# EAGLE design ESP32-Proto2-Layout-D1 (EAGLE 9.6.2)
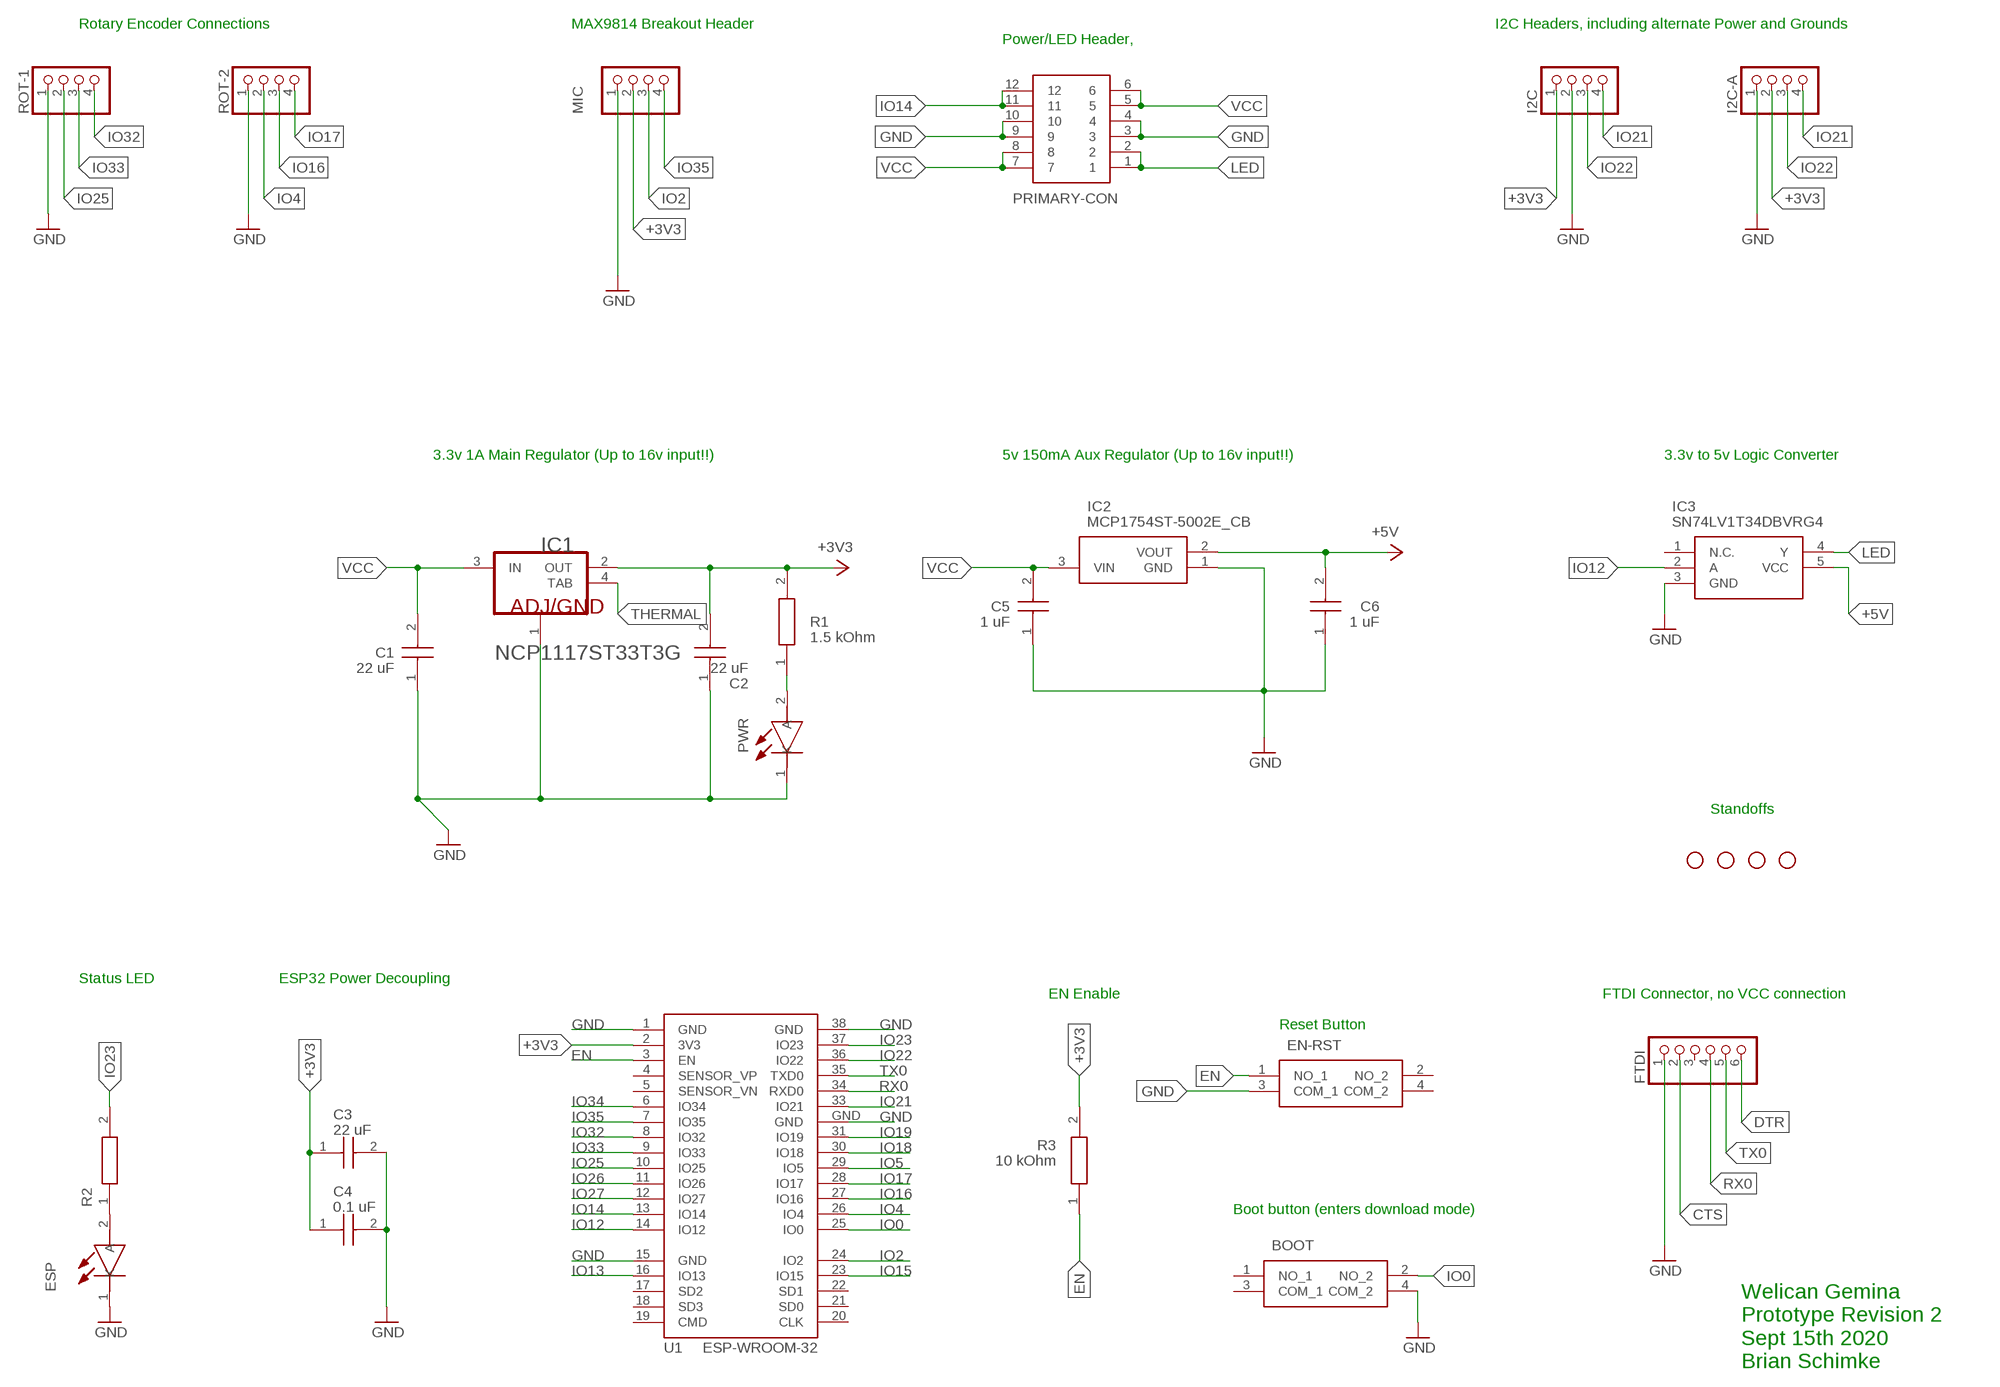
[diagram p0: schematic, sheet 1]

## Parts
BOOT  PTS647SK70SMTR2LFS  [PTS647SK70SMTR2LFS]
C1  22 uF  C1206C226M4PACTU  [CAPC3216X180N]
C2  22 uF  C1206C226M4PACTU  [CAPC3216X180N]
C3  22 uF  C1206C226M4PACTU  [CAPC3216X180N]
C4  0.1 uF  C1206C226M4PACTU  [CAPC3216X180N]
C5  1 uF  C1206C226M4PACTU  [CAPC3216X180N]
C6  1 uF  C1206C226M4PACTU  [CAPC3216X180N]
EN-RST  PTS647SK70SMTR2LFS  [PTS647SK70SMTR2LFS]
ESP  150120AS75000  [LEDSC320X160X78-2N]
FTDI  PINHD-1X6  [1X06]
H1  STAND-OFF  [STAND-OFF]
H2  STAND-OFF  [STAND-OFF]
H3  STAND-OFF  [STAND-OFF]
H4  STAND-OFF  [STAND-OFF]
I2C  PINHD-1X4  [1X04]
I2C-A  PINHD-1X4  [1X04]
IC1  ON_SEMICONDUCTOR_NCP1117ST33T3GON_SEMICONDUCTOR_NCP1117ST33T3G_0_0  [ON_SEMICONDUCTOR_NCP1117ST33T3G_0]
IC2  MCP1754ST-5002E_CB  [SOT95P255X145-3N]
IC3  SN74LV1T34DBVRG4  [SOT95P280X145-5N]
MIC  PINHD-1X4  [1X04]
PRIMARY-CON  1-2834015-6  [SHDR12W90P508X254_2X6_1824X128]
PWR  150120AS75000  [LEDSC320X160X78-2N]
R1  1.5 kOhm  CRCW12061K00FKEB  [RESC3216X60N]
R2  CRCW12061K00FKEB  [RESC3216X60N]
R3  10 kOhm  CRCW12061K00FKEB  [RESC3216X60N]
ROT-1  PINHD-1X4  [1X04]
ROT-2  PINHD-1X4  [1X04]
U1  ESP-WROOM-32  [ESP-WROOM-32]

## Nets
+3V3: C2.2 C3.1 C4.1 I2C-A.2 I2C.1 IC1.2(OUT) MIC.2 R1.2 R3.2 U1.2(3V3)
+5V: C6.2 IC2.2(VOUT) IC3.5(VCC)
CTS: FTDI.2
DTR: FTDI.6
EN: EN-RST.1(NO_1) R3.1 U1.3(EN)
GND: BOOT.4(COM_2) C1.1 C2.1 C3.2 C4.2 C5.1 C6.1 EN-RST.3(COM_1) ESP.1(K) FTDI.1 I2C-A.1 I2C.2 IC1.1(ADJ/GND) IC2.1(GND) IC3.3(GND) MIC.1 PRIMARY-CON.3 PRIMARY-CON.4 PRIMARY-CON.9 PRIMARY-CON.10 PWR.1(K) ROT-1.1 ROT-2.1 U1.1(GND) U1.15(GND) U1.38(GND) U1.GND
IO0: BOOT.2(NO_2) U1.25(IO0)
IO2: MIC.3 U1.24(IO2)
IO4: ROT-2.2 U1.26(IO4)
IO5: U1.29(IO5)
IO12: IC3.2(A) U1.14(IO12)
IO13: U1.16(IO13)
IO14: PRIMARY-CON.11 PRIMARY-CON.12 U1.13(IO14)
IO15: U1.23(IO15)
IO16: ROT-2.3 U1.27(IO16)
IO17: ROT-2.4 U1.28(IO17)
IO18: U1.30(IO18)
IO19: U1.31(IO19)
IO21: I2C-A.4 I2C.4 U1.33(IO21)
IO22: I2C-A.3 I2C.3 U1.36(IO22)
IO23: R2.2 U1.37(IO23)
IO25: ROT-1.2 U1.10(IO25)
IO26: U1.11(IO26)
IO27: U1.12(IO27)
IO32: ROT-1.4 U1.8(IO32)
IO33: ROT-1.3 U1.9(IO33)
IO34: U1.6(IO34)
IO35: MIC.4 U1.7(IO35)
LED: IC3.4(Y) PRIMARY-CON.1 PRIMARY-CON.2
N$1: PWR.2(A) R1.1
N$2: ESP.2(A) R2.1
RX0: FTDI.4 U1.34(RXD0)
THERMAL: IC1.4(TAB)
TX0: FTDI.5 U1.35(TXD0)
VCC: C1.2 C5.2 IC1.3(IN) IC2.3(VIN) PRIMARY-CON.5 PRIMARY-CON.6 PRIMARY-CON.7 PRIMARY-CON.8
Unconnected: BOOT.1(NO_1) BOOT.3(COM_1) EN-RST.2(NO_2) EN-RST.4(COM_2) FTDI.3 IC3.1(N.C.) U1.4(SENSOR_VP) U1.5(SENSOR_VN) U1.17(SD2) U1.18(SD3) U1.19(CMD) U1.20(CLK) U1.21(SD0) U1.22(SD1)

## Notes on the sheet
- Rotary Encoder Connections | MAX9814 Breakout Header | I2C Headers, including alternate Power and Grounds
- Power/LED Header,
- 3.3v 1A Main Regulator (Up to 16v input!!) | 5v 150mA Aux Regulator (Up to 16v input!!) | 3.3v to 5v Logic Converter
- Standoffs
- Status LED | ESP32 Power Decoupling
- EN Enable | FTDI Connector, no VCC connection
- Reset Button
- Boot button (enters download mode)
- Welican Gemina
  Prototype Revision 2
  Sept 15th 2020
  Brian Schimke

## Library data of the parts
BOOT EN-RST = SamacSys_Parts:PTS647SK70SMTR2LFS: Tactile Switches 50mA 12VDC, 2.5N 7.0mm H, G leads Source: Datasheet <https:////www.ckswitches.com/media/2567/pts647.pdf>; DESCRIPTION: Tactile Switches 50mA 12VDC, 2.5N 7.0mm H, G leads; HEIGHT: 7.2mm; MANUFACTURER_NAME: C & K COMPONENTS; MANUFACTURER_PART_NUMBER: PTS647SK70SMTR2LFS; MOUSER_PART_NUMBER: 611-PTS647SK70SMTR2L; MOUSER_PRICE-STOCK: https://www.mouser.co.uk/ProductDetail/CK/PTS647SK70SMTR2LFS?qs=PqoDHHvF64%2FG2CdR6DYUFw%3D%3D
C1-C6 = SamacSys_Parts:C1206C226M4PACTU: KEMET 1206 (3216M) 22uF MLCC 16V dc +/-20% SMD C1206C226M4PACTU Source: Datasheet <https://api.kemet.com/component-edge/download/specsheet/C1206C226M4PACTU.pdf>; DESCRIPTION: KEMET 1206 (3216M) 22uF MLCC 16V dc +/-20% SMD C1206C226M4PACTU; HEIGHT: 1.8mm; MANUFACTURER_NAME: Kemet; MANUFACTURER_PART_NUMBER: C1206C226M4PACTU; MOUSER_PART_NUMBER: 80-C1206C226M4P; MOUSER_PRICE-STOCK: https://www.mouser.co.uk/ProductDetail/KEMET/C1206C226M4PACTU?qs=vBH1GPjCw2UZFSd%252B4IU1Qg%3D%3D
ESP PWR = SamacSys_Parts:150120AS75000: WL-SMCW SMD chip LED top view monocolor%D waterclear Source: Datasheet <http://katalog.we-online.com/led/datasheet/150120AS75000.pdf>; DESCRIPTION: WL-SMCW SMD chip LED top view monocolor%D waterclear; HEIGHT: mm; MANUFACTURER_NAME: Wurth Elektronik; MANUFACTURER_PART_NUMBER: 150120AS75000; MOUSER_PART_NUMBER: 710-150120AS75000; MOUSER_PRICE-STOCK: https://www.mouser.co.uk/ProductDetail/Wurth-Elektronik/150120AS75000?qs=LlUlMxKIyB3dthGDbNsiXQ%3D%3D
FTDI = pinhead:PINHD-1X6: PIN HEADER
H1-H4 = SparkFun-Hardware:STAND-OFF: Stand Off Drill holes for mechanically mounting via screws, standoffs, etc. Note: Use the keepout ring to avoid running the screw head into surrounding components. Variant Overviews STAND-OFF - Mechanical footprint for a #4 phillips button head screw. STAND-OFF-TIGHT - Mechanical footprint for a #4 phillips button head screw, Example SparkFun Products Screw - Phillips Head (1/4", 4-40, 10 pack) <https://www.sparkfun.com/products/10453> (PRT-10453) Screw - Phillips Head (1/2", 4-40, 10 pack) <https://www.sparkfun.com/products/10452> (PRT-10452) Screw - Phillips Head (3/4", 4-40, 10 pack) <https://www.sparkfun.com/products/10451> (PRT-10451) Screw - Phillips Head (1", 4-40, 10 pack) <https://www.sparkfun.com/products/10450> (PRT-10450)
I2C I2C-A MIC ROT-1 ROT-2 = pinhead:PINHD-1X4: PIN HEADER
IC1 = ON Semiconductor - NCP1117ST33T3G:ON_SEMICONDUCTOR_NCP1117ST33T3G: ONSC-NCP1117-SOT223-4; CASE_CODE_IMPERIAL: 0603; CASE_CODE_METRIC: 1608; CASE_PACKAGE: 0603; CIIVA_IDS: 19354120; COMPONENT_LINK_1_DESCRIPTION: Manufacturer URL; COMPONENT_LINK_1_URL: http://www.onsemi.com/; DATASHEET: http://www.onsemi.com/pub_link/Collateral/NCP1117-D.PDF; DATASHEET_VERSION: Rev. 27, 09/2014; FOOTPRINT_VARIANT_NAME_0: Manufacturer Recommended; HEIGHT: 0.45 mm; IMPORTED: yes; IMPORTED_FROM: vault; IMPORT_TS: 1521845423; LENGTH: 1.55 mm; MAX_OPERATING_TEMPERATURE: 155 degC; MF: ON Semiconductor; MIN_OPERATING_TEMPERATURE: -55 degC; MOUNT: Surface Mount; MPN: NCP1117ST33T3G; PACKAGE: SOT-223-4-318H-01_A; PACKAGE_DESCRIPTION: 4-Pin Small Outline Transistor, Body 6.5 x 3.5 mm, Pitch 2.3 mm; PACKAGE_QUANTITY: 5000; PACKAGING: Tape and Reel; POWER_RATING: 100 mW; PREFIX: U; RADIATION_HARDENING: No; REACH_SVHC: Unknown; RELEASE_DATE: 1475065185; RESISTANCE: 220 kohm; RO_HSCOMPLIANT: true; TOLERANCE: 1%; TYPE_RESISTOR: Thick Film; VAULT_GUID: C6E429D0-32F2-4CA3-9C68-29F3FC9DADEB; VAULT_REVISION: 6AD56B9F-4B97-41F2-91E8-97C557B92B31; VOLTAGE_RATING: 75 V; WEIGHT: 7.1E-05 oz; WIDTH: 0.85 mm
IC2 = SamacSys_Parts:MCP1754ST-5002E_CB: LDO regulator,voltage,5.0V,150mA,SOT23A Microchip MCP1754ST-5002E/CB, Single Linear Voltage Regulator, 150mA 5 V, 2%, 3-Pin SOT-23A Source: Datasheet; DESCRIPTION: LDO regulator,voltage,5.0V,150mA,SOT23A Microchip MCP1754ST-5002E/CB, Single Linear Voltage Regulator, 150mA 5 V, 2%, 3-Pin SOT-23A; HEIGHT: 1.45mm; MANUFACTURER_NAME: Microchip; MANUFACTURER_PART_NUMBER: MCP1754ST-5002E/CB; MOUSER_PART_NUMBER: 579-MCP1754T-5002ECB; MOUSER_PRICE-STOCK: https://www.mouser.co.uk/ProductDetail/Microchip-Technology/MCP1754ST-5002E-CB?qs=geWWqIMx8YpBnNSotTcMsA%3D%3D
IC3 = SamacSys_Parts:SN74LV1T34DBVRG4: Single Power Supply BUFFER Logic Level Shifter (no enable) Source: Datasheet <http://www.ti.com/lit/gpn/sn74lv1t34>; DESCRIPTION: Single Power Supply BUFFER Logic Level Shifter (no enable); HEIGHT: 1.45mm; MANUFACTURER_NAME: Texas Instruments; MANUFACTURER_PART_NUMBER: SN74LV1T34DBVRG4; MOUSER_PART_NUMBER: 595-SN74LV1T34DBVRG4; MOUSER_PRICE-STOCK: https://www.mouser.co.uk/ProductDetail/Texas-Instruments/SN74LV1T34DBVRG4?qs=vdi0iO8H4N10R%252Bt%252BjmxZrg%3D%3D
PRIMARY-CON = SamacSys_Parts:1-2834015-6: Fixed Terminal Blocks 6POS 2.54MM TES CONN Source: Datasheet; DESCRIPTION: Fixed Terminal Blocks 6POS 2.54MM TES CONN; HEIGHT: 13.9mm; MANUFACTURER_NAME: TE Connectivity; MANUFACTURER_PART_NUMBER: 1-2834015-6; MOUSER_PART_NUMBER: 571-1-2834015-6; MOUSER_PRICE-STOCK: https://www.mouser.co.uk/ProductDetail/TE-Connectivity-PB/1-2834015-6?qs=0ns%252B%2F2Cp7jExtUGsWLqwmw%3D%3D
R1-R3 = SamacSys_Parts:CRCW12061K00FKEB: Thick Film Resistors - SMD 1/4watt 1Kohms 1% Source: Datasheet <http://www.vishay.com/docs/20035/dcrcwe3.pdf>; DESCRIPTION: Thick Film Resistors - SMD 1/4watt 1Kohms 1%; HEIGHT: 0.6mm; MANUFACTURER_NAME: Vishay; MANUFACTURER_PART_NUMBER: CRCW12061K00FKEB; MOUSER_PART_NUMBER: 71-CRCW12061K00FKEB; MOUSER_PRICE-STOCK: https://www.mouser.co.uk/ProductDetail/Vishay-Dale/CRCW12061K00FKEB?qs=3XLFQ9LoC1wOYUVdt2fbOg%3D%3D
U1 = esp32:ESP-WROOM-32: Espressif Systems ESP-WROOM-32

## Board
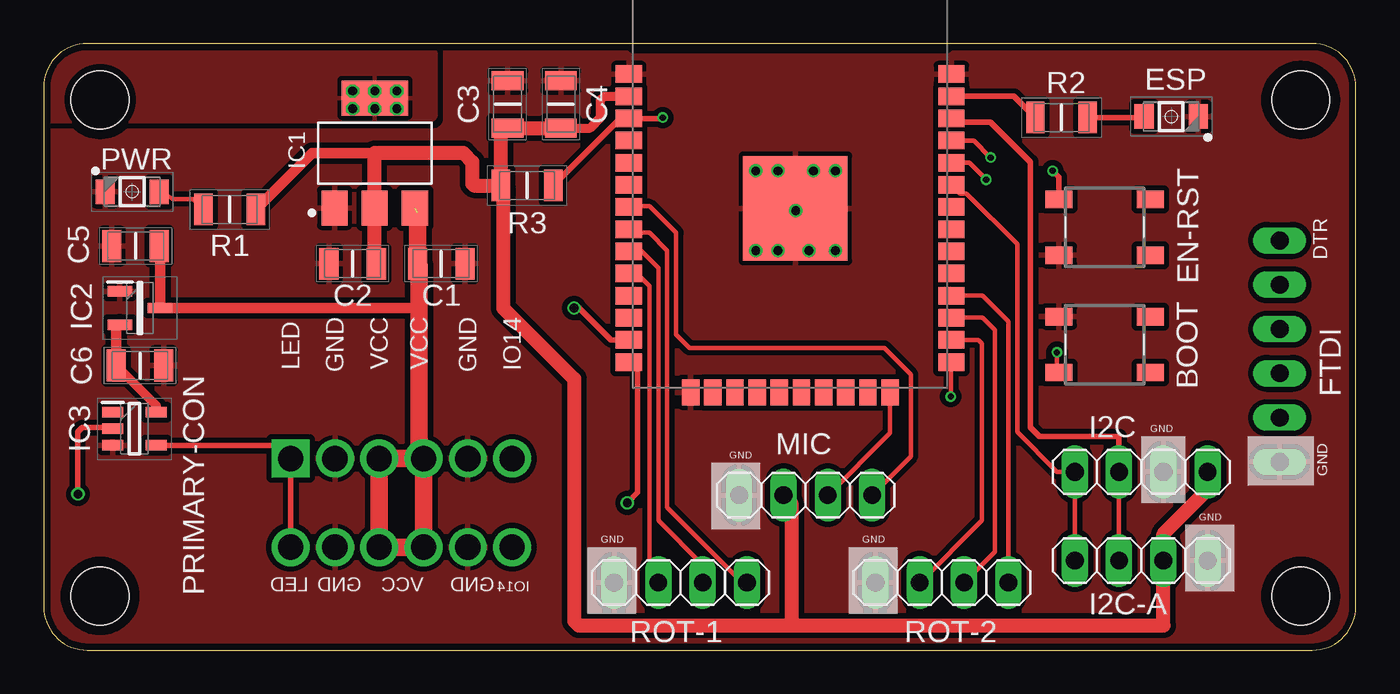
[diagram p1: board, top side]
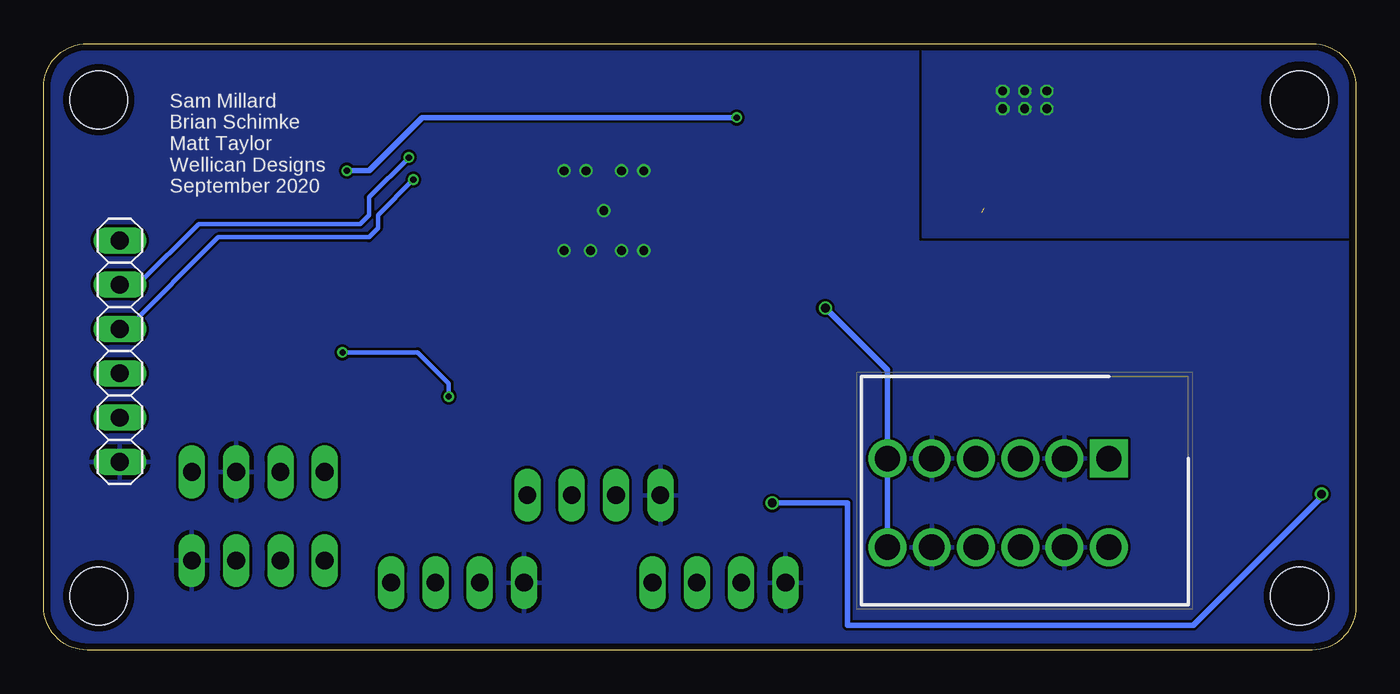
[diagram p2: board, bottom side, seen from below]

Size 75.23 x 34.79 mm. Coordinates in mm from the lower left corner, seen from the top.
Outline: 75.24,2.5 75.24,32.29 arc90 72.74,34.79 2.5,34.79 arc90 0,32.29 0,2.5 arc90 2.5,0 72.74,0 arc90 75.24,2.5
Copper layers (1*16): Top 0.035559375mm / dielectric 1.6mm / Bottom 0.035559375mm
Design rules "oshpark-2layer": minimum track width 6mil, minimum drill 10mil, track to track 6mil, track to pad 6mil, pad to pad 6mil, via to via 6mil, smd to smd 6mil, copper to edge 15mil, drill to drill 6mil, minimum pad ring 5mil, minimum via ring 5mil, stop-mask expansion 2.5mil, vias tented up to drill 0mil, thermal gap 10mil

### Footprints (pad centres in the part's own frame; a part is rotated, then mirrored left to right if it is on the bottom)
PTS647SK70SMTR2LFS = smd 1.55 x 1: 1 -2.625,1.6; 2 2.625,1.6; 3 -2.625,-1.6; 4 2.625,-1.6
CAPC3216X180N = smd 1.1 x 1.82: 1 -1.36,0; 2 1.36,0
LEDSC320X160X78-2N = smd 1.1 x 1.4: 1 -1.55,0; 2 1.55,0
1X06 = drill 1.016 long: 1 -6.35,0; 2 -3.81,0; 3 -1.27,0; 4 1.27,0; 5 3.81,0; 6 6.35,0
STAND-OFF = hole 3.302: 0,0
1X04 = drill 1.016 long: 1 -3.81,0; 2 -1.27,0; 3 1.27,0; 4 3.81,0
ON_SEMICONDUCTOR_NCP1117ST33T3G_0 = smd 2 x 1.5: 1 -3.15,2.3; 2 -3.15,0; 3 -3.15,-2.3 | smd 2 x 3.8: 4 3.15,0
SOT95P255X145-3N = smd 1.4 x 0.6: 1 -1.15,0.95; 2 -1.15,-0.95; 3 1.15,0
SOT95P280X145-5N = smd 1.2 x 0.6: 1 -1.25,0.95; 2 -1.25,0; 3 -1.25,-0.95; 4 1.25,-0.95; 5 1.25,0.95
SHDR12W90P508X254_2X6_1824X128 = drill 1.45 pad 2.175 square: 1 0,0 | drill 1.45 pad 2.175: 2 0,5.08; 3 2.54,0; 4 2.54,5.08; 5 5.08,0; 6 5.08,5.08; 7 7.62,0; 8 7.62,5.08; 9 10.16,0; 10 10.16,5.08; 11 12.7,0; 12 12.7,5.08
RESC3216X60N = smd 1.05 x 1.8: 1 -1.5,0; 2 1.5,0
ESP-WROOM-32 = smd 1.5 x 1: 1 -9.25,7; 2 -9.25,5.73; 3 -9.25,4.46; 4 -9.25,3.19; 5 -9.25,1.92; 6 -9.25,0.65; 7 -9.25,-0.62; 8 -9.25,-1.89; 9 -9.25,-3.16; 10 -9.25,-4.43; 11 -9.25,-5.7; 12 -9.25,-6.97; 13 -9.25,-8.24; 14 -9.25,-9.51; 25 9.25,-9.51; 26 9.25,-8.24; 27 9.25,-6.97; 28 9.25,-5.7; 29 9.25,-4.43; 30 9.25,-3.16; 31 9.25,-1.89; 32 9.25,-0.62; 33 9.25,0.65; 34 9.25,1.92; 35 9.25,3.19; 36 9.25,4.46; 37 9.25,5.73; 38 9.25,7 | smd 1 x 1.5: 15 -5.7,-11.25; 16 -4.43,-11.25; 17 -3.16,-11.25; 18 -1.89,-11.25; 19 -0.62,-11.25; 20 0.65,-11.25; 21 1.92,-11.25; 22 3.19,-11.25; 23 4.46,-11.25; 24 5.73,-11.25 | smd 6 x 6: GND 0.3,-0.7

### Placement (x,y rotation side)
BOOT  60.83,17.53 180 top
C1  22.8,22.16 180 top
C2  17.72,22.16 0 top
C3  26.61,31.31 90 top
C4  29.65,31.31 90 top
C5  5.27,23.18 0 top
C6  5.52,16.32 180 top
EN-RST  60.83,24.26 0 top
ESP  64.64,30.61 180 top
FTDI  70.87,17.14 90 bottom
H1  3.24,31.56 0 top
H2  72.07,3.11 0 top
H3  72.07,31.56 0 top
H4  3.24,3.11 0 top
I2C  62.93,10.22 180 top
I2C-A  62.93,5.14 180 top
IC1  18.99,28.51 90 top
IC2  5.52,19.62 0 top
IC3  5.21,12.7 0 top
MIC  43.69,8.89 0 top
PRIMARY-CON  14.16,10.99 180 bottom
PWR  5.08,26.29 0 top
R1  10.67,25.27 0 top
R2  58.36,30.54 180 top
R3  27.71,26.65 180 top
ROT-1  36.51,3.87 0 top
ROT-2  51.5,3.87 0 top
U1  42.8,26.04 0 top

### Tracks (layer width: path | path; a pad name or v marks a point on that pad's centre or on a via)
+3V3
  Top 0.508: 24.57,26.73 24.66,26.65 | 18.95,28.22 19.24,28.51 | 26.21,29.55 C3.1 | C4.1 31.34,29.95 31.94,30.54 31.94,31.56 32.15,31.77 U1.2 | 18.95,22.29 C2.2
  Top 0.61: 19.24,28.51 15.41,28.51 R1.2
  Top 0.813: 24.57,26.73 24.57,28 24.07,28.51 19.24,28.51 18.99,28.51 IC1.2 18.99,22.16 C2.2 | 24.66,26.65 R3.2 | R3.2 26.21,29.55 | C3.1 C4.1 | I2C.1 66.74,9.21 64.2,6.67 I2C-A.2 64.2,1.42 42.86,1.42 | R3.2 26.35,26.51 26.35,19.62 30.42,15.56 30.42,1.68 30.67,1.42 42.86,1.42 | MIC.2 42.86,8.45 42.86,1.42
+5V
  Top 0.508: C6.2 6.46,14.03 IC3.5
  Top 0.61: C6.2 4.16,18.46 IC2.2
EN  (via drill 0.35)
  Top 0.305: R3.1 33.06,30.5 U1.3 35.45,30.5 v35.5,30.54 | v57.85,27.5 58.21,27.14 EN-RST.1
  Bottom 0.305: v35.5,30.54 53.53,30.54 56.58,27.5 v57.85,27.5
GND  (via drill 0.5)
  other vias: 40.83,27.5 42.1,27.5 44.13,27.5 45.4,27.5 40.83,22.92 42.1,22.92 43.12,25.21 43.88,22.92 45.4,22.92
  pour Top (isolate 0.305, rank 2): 0.19,34.61 75.12,34.61 75.12,32.83 75.12,0.06 0.19,0.06 0.19,1.08
  pour Bottom (rank 2): 0.19,0.06 0.7,0.06 75.12,0.06 75.12,0.57 75.12,34.61 74.87,34.61 0.19,34.35
IO0  (via drill 0.35)
  Top 0.254: BOOT.2 58.1,16.03 v58.1,17.08 | U1.25 52.01,16.48 v52.01,14.54
  Bottom 0.254: v58.1,17.08 53.78,17.08 52.01,15.3 v52.01,14.54
IO2
  Top 0.254: U1.24 48.53,12.46 MIC.3
IO4
  Top 0.254: U1.26 53.58,17.79 53.78,17.59 53.78,7.43 ROT-2.2
IO12  (via drill 0.5)
  Top 0.305: U1.14 34.06,16.02 34.06,9.04 v33.46,8.45 | v1.97,8.95 1.97,12.51 2.22,12.76 3.89,12.76 IC3.2
  Bottom 0.305: v33.46,8.45 29.15,8.45 29.15,1.42 9.33,1.42 1.97,8.79 v1.97,8.95
IO14  (via drill 0.5)
  Top 0.305: U1.13 32.53,17.79 30.71,19.62 v30.42,19.62
  Bottom 0.305: v30.42,19.62 26.86,16.07 PRIMARY-CON.11 PRIMARY-CON.12
IO16
  Top 0.254: U1.27 53.83,19.07 54.55,18.35 54.55,5.65 ROT-2.3
IO17
  Top 0.254: U1.28 53.83,20.34 55.31,18.86 ROT-2.4
IO21
  Top 0.254: U1.33 52.54,26.19 52.91,26.19 55.82,23.29 55.82,12.51 58.1,10.22 I2C.4 I2C-A.4
IO22
  Top 0.254: I2C.3 I2C-A.3
  Top 0.305: U1.36 52.25,30.29 54.29,30.29 56.58,28 56.58,12.76 57.09,12.26 61.66,12.26 I2C.3
IO23
  Top 0.305: U1.37 55.64,31.77 R2.2
IO25
  Top 0.254: U1.10 34.02,21.61 34.73,20.89 34.73,4.38 ROT-1.2
IO32
  Top 0.254: U1.8 33.75,23.94 34.73,23.94 35.75,22.92 35.75,8.19 40.07,3.87 ROT-1.4
IO33
  Top 0.254: U1.9 34.28,22.88 35.24,21.91 35.24,7.43 37.78,4.89 ROT-1.3
IO35
  Top 0.254: MIC.4 49.72,11.11 49.72,15.81 48.2,17.34 37.02,17.34 36.26,18.1 36.26,23.94 34.73,25.46 33.6,25.46 U1.7
LED
  Top 0.305: IC3.4 13.4,11.75 PRIMARY-CON.1 PRIMARY-CON.2
N$1
  Top 0.254: R1.1 8.58,25.86 7.39,25.86 6.78,26.29 PWR.2
N$2
  Top 0.305: ESP.2 63.03,30.54 R2.1
RX0  (via drill 0.35)
  Top 0.254: U1.34 53.07,27.95 v54.04,26.99
  Bottom 0.254: v54.04,26.99 56.07,24.96 56.07,24.19 56.58,23.69 65.21,23.69 70.49,18.41 FTDI.4
THERMAL  (via drill 0.5)
  other vias: 17.72,32.07 18.99,32.07 20.26,32.07 20.26,31.05 18.99,31.05 17.72,31.05
  pour Top: 1.97,34.61 22.03,34.61 arc-90 22.54,34.1 22.54,30.8 arc-90 22.03,30.29 -0.06,30.29 -0.06,32.58 arc-90
  pour Bottom (isolate 0.254): 1.71,34.35 24.83,34.35 24.83,23.69 0.44,23.69 0.44,33.08 arc-90
TX0  (via drill 0.35)
  Top 0.254: U1.35 53.33,29.23 v54.29,28.26
  Bottom 0.254: v54.29,28.26 56.58,25.97 56.58,24.96 57.09,24.45 66.36,24.45 69.85,20.95 FTDI.5
VCC  (1 unrouted)
  Top 0.61: 21.53,19.62 IC2.3 6.67,23.13 C5.2
  Top 0.813: PRIMARY-CON.7 21.53,11.24 | 21.53,22.07 C1.2
  Top 1.016: 21.53,22.07 21.53,19.62 21.53,11.24 | C1.2 21.44,25.1 | PRIMARY-CON.6 PRIMARY-CON.8 PRIMARY-CON.7 PRIMARY-CON.5 PRIMARY-CON.6

### Text on the board
tPlace: LED | GND | VCC | GND | IO14
tNames: DTR | LED | GND | VCC | VCC | GND | IO14 | GND | GND | GND | GND | GND | GND
bNames: Sam Millard / Brian Schimke / Matt Taylor / Wellican Designs / September 2020